# Altium schematic sheet ClubNIKA.SchDoc
size A1
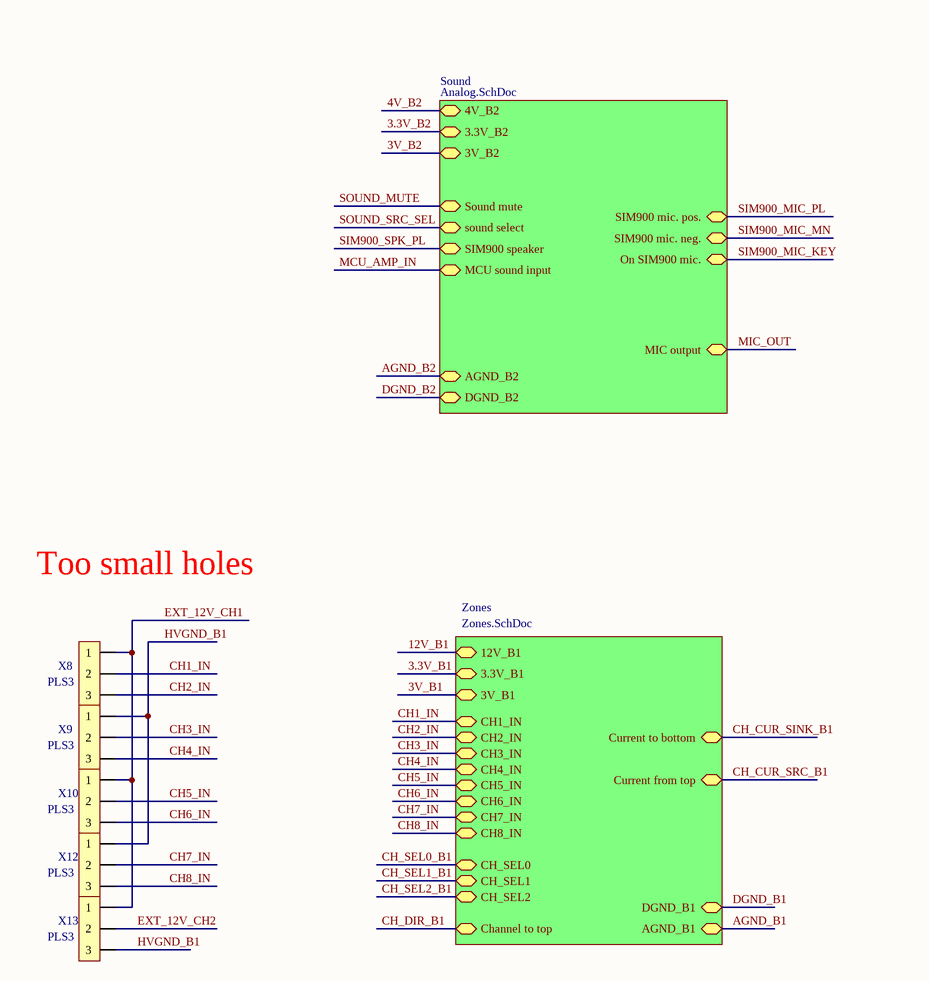
[diagram p0: ClubNIKA.SchDoc, top left]
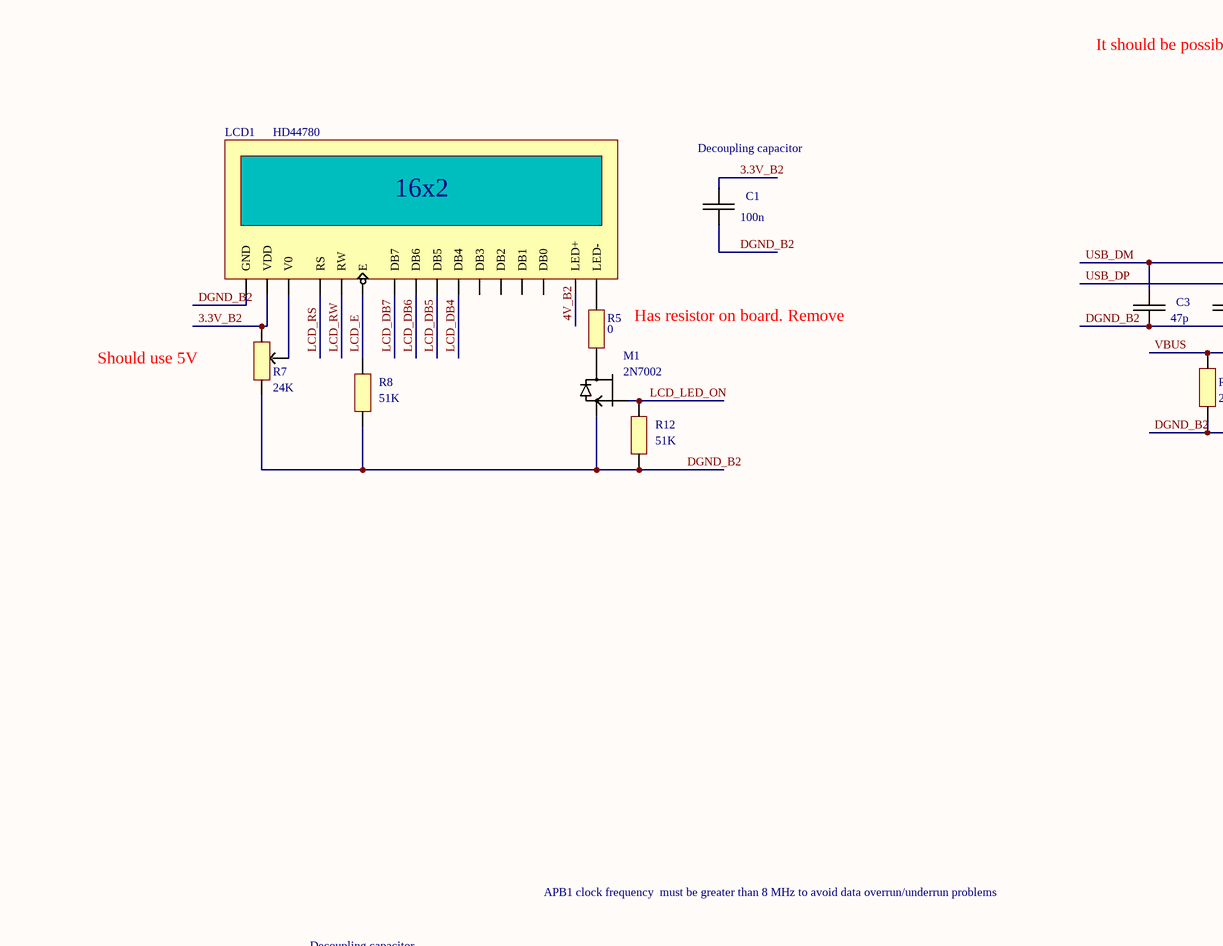
[diagram p1: ClubNIKA.SchDoc, top middle]
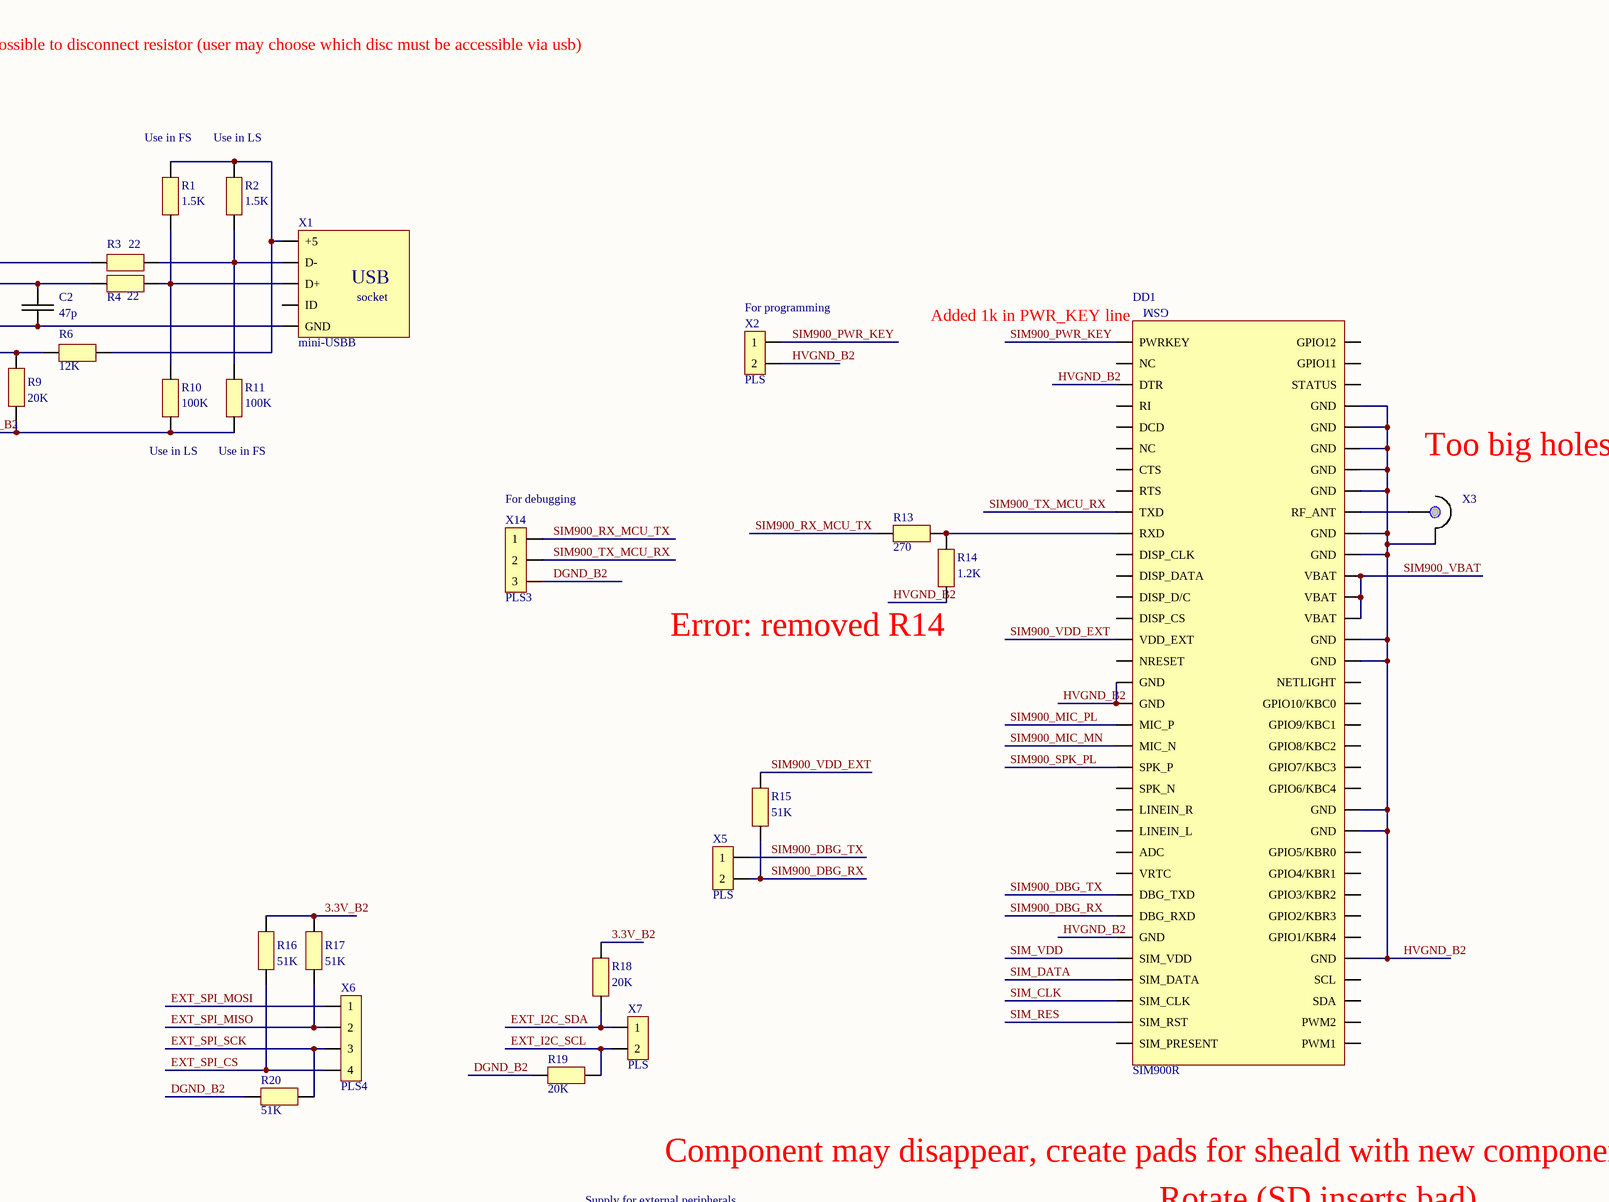
[diagram p2: ClubNIKA.SchDoc, top right]
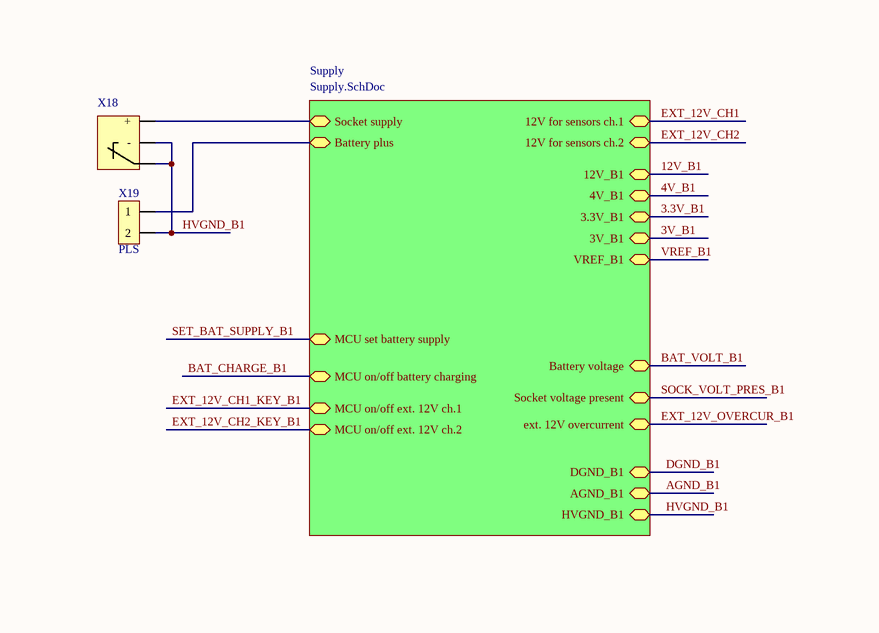
[diagram p3: ClubNIKA.SchDoc, bottom left]
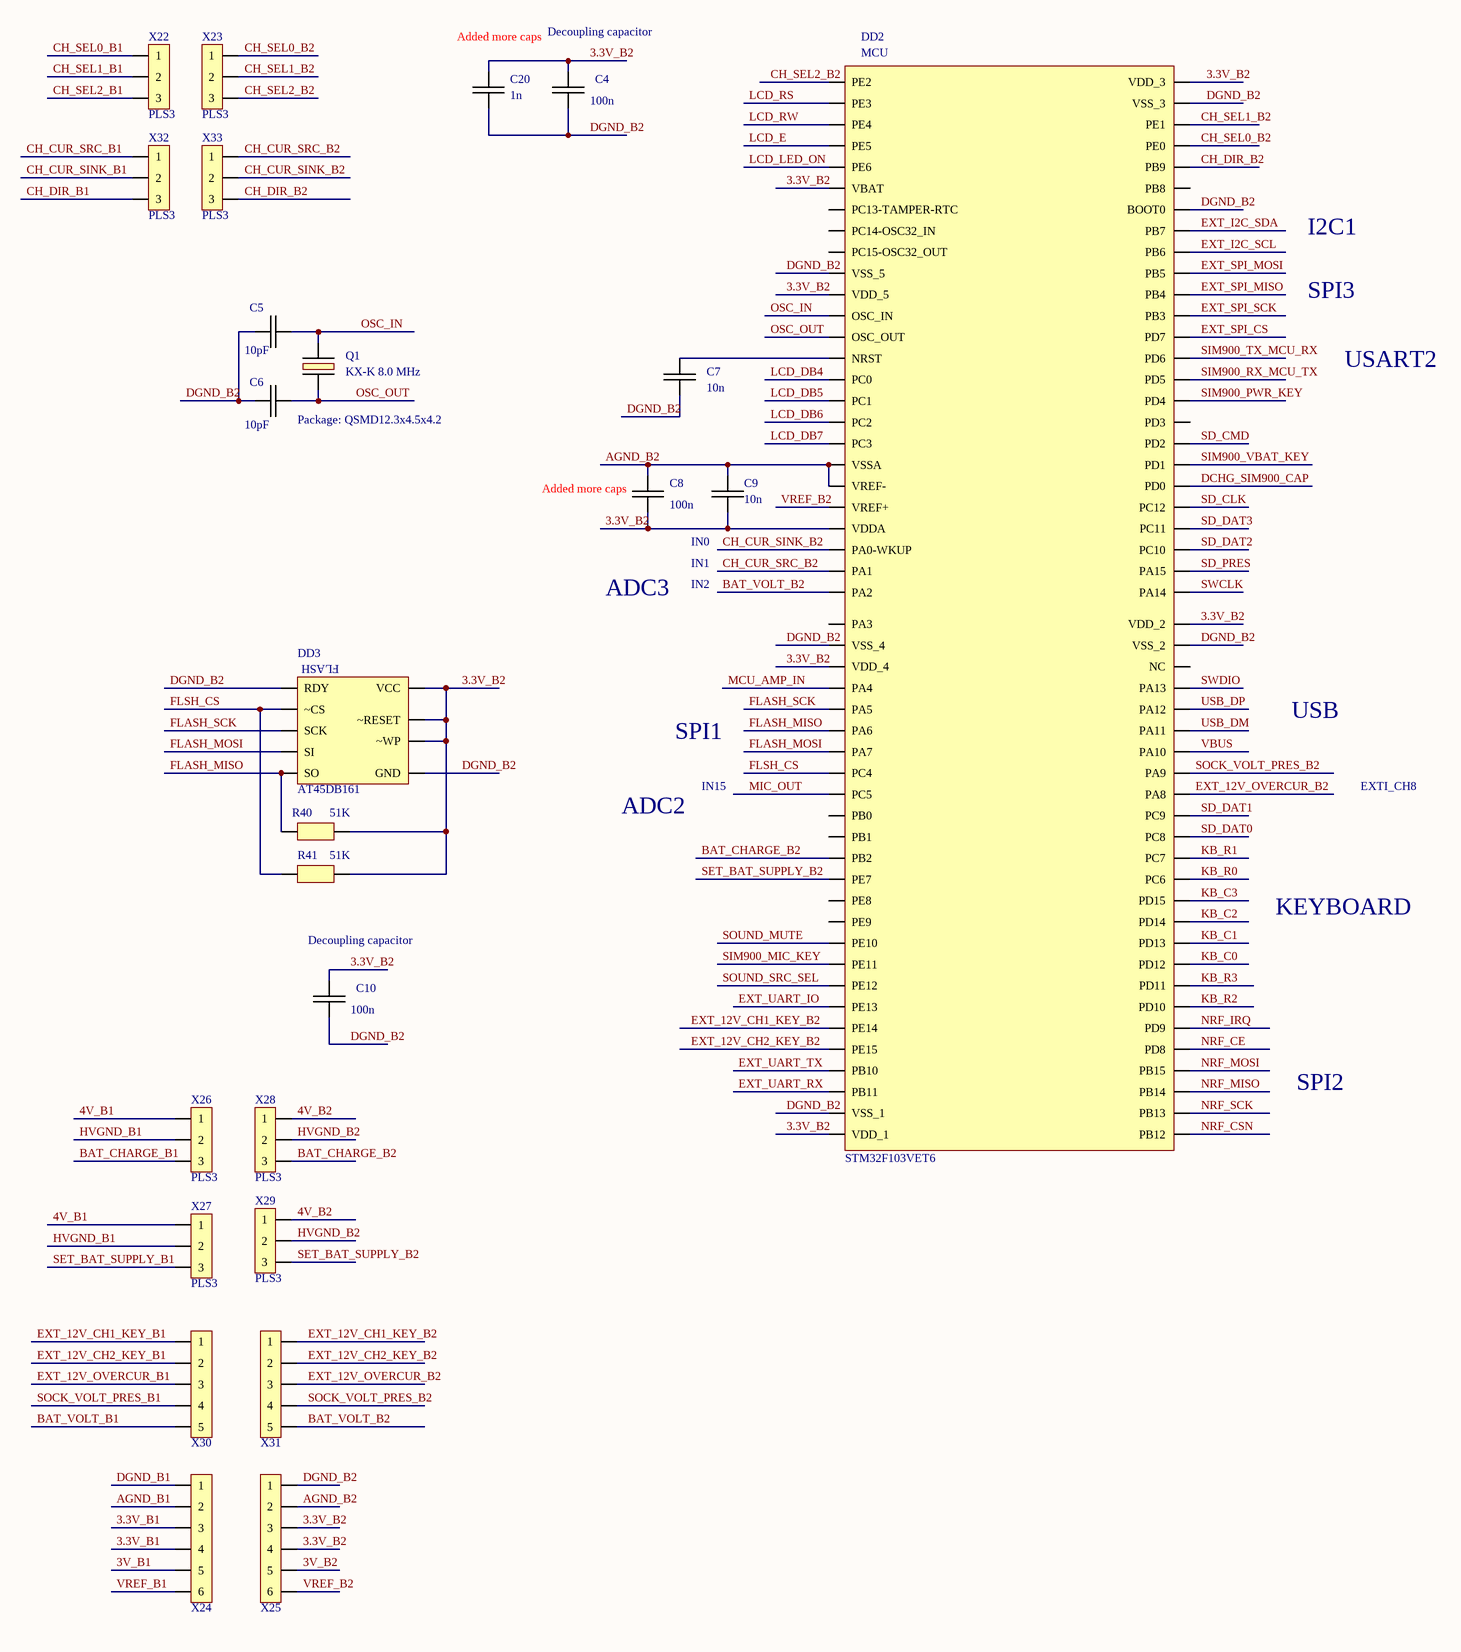
[diagram p4: ClubNIKA.SchDoc, bottom middle]
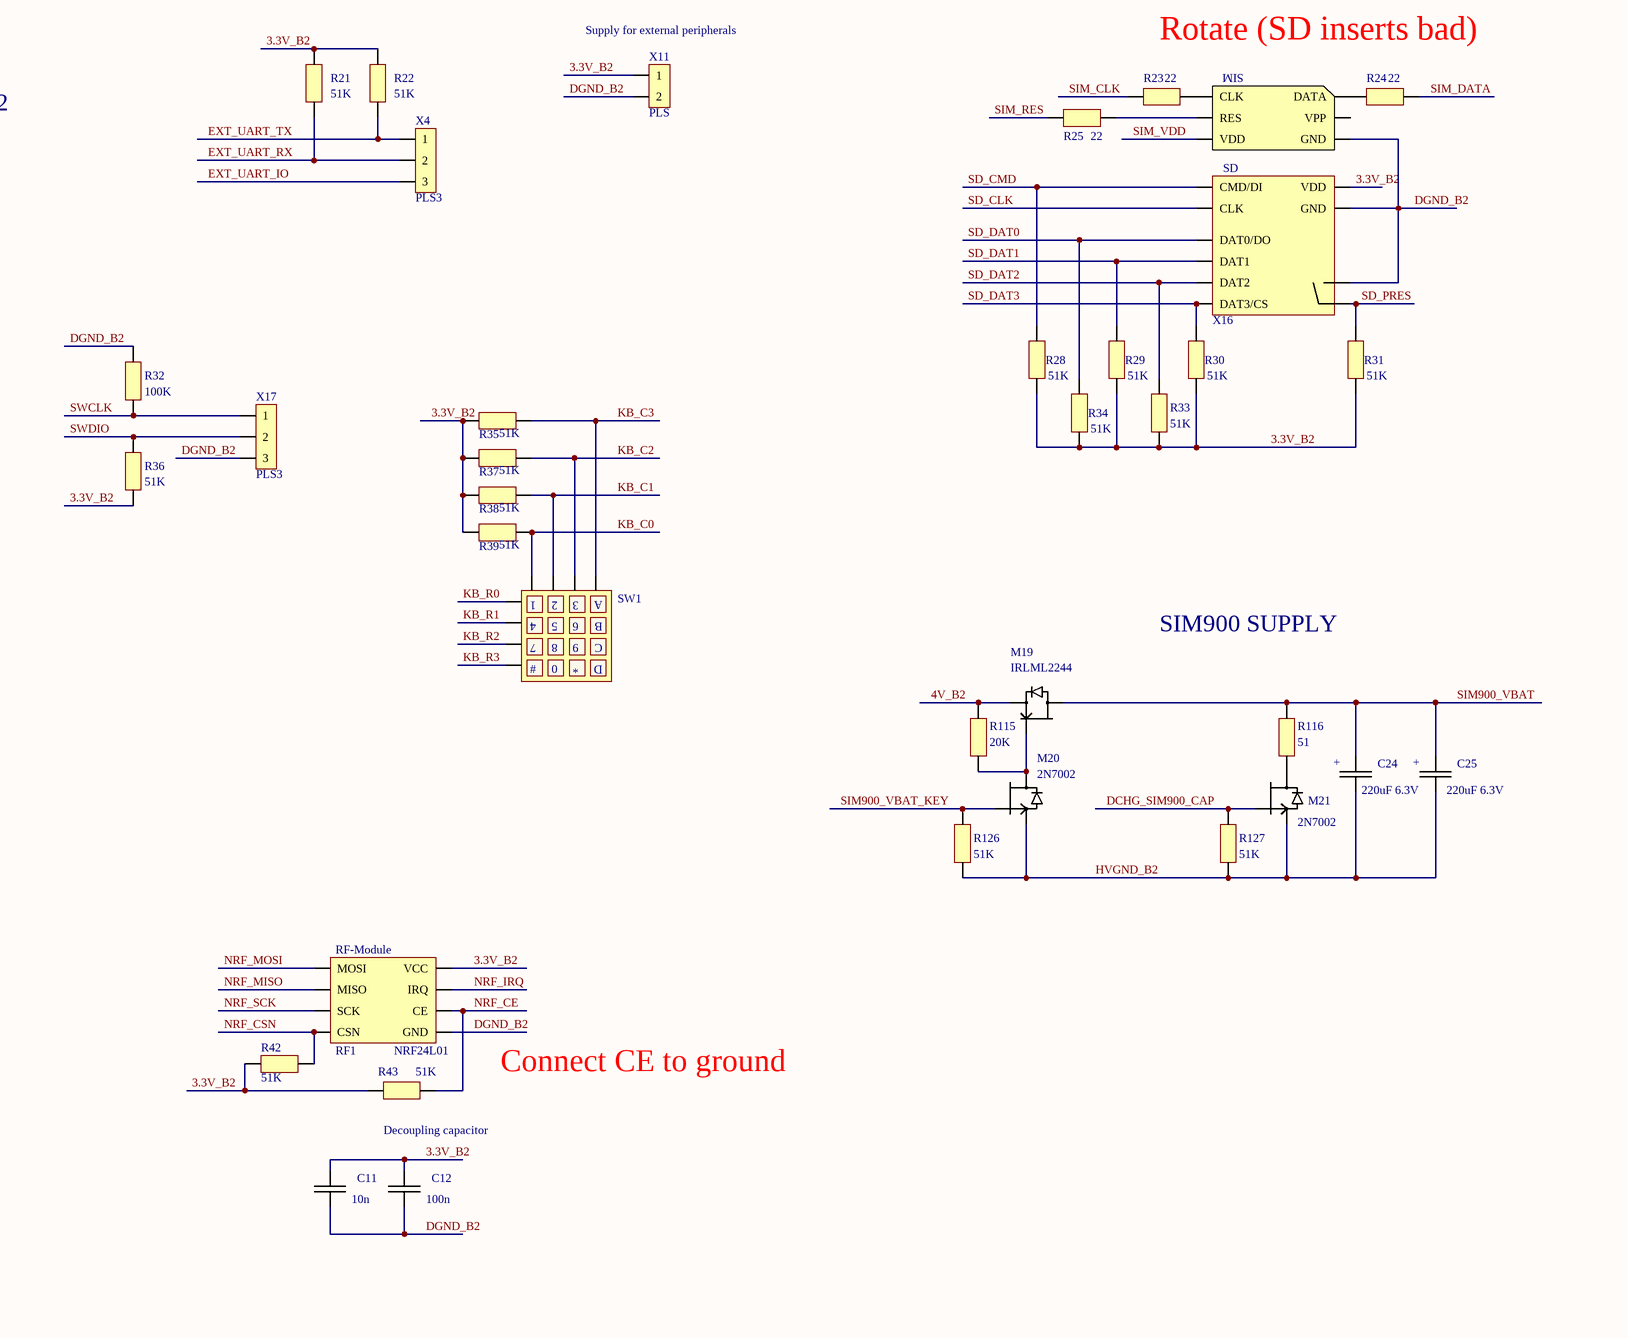
[diagram p5: ClubNIKA.SchDoc, bottom right]

## Parts
C1  100n  [0805]
C2  47p  [0805]
C3  47p  [0805]
C4  100n  [0805]
C5  10pF  [0805]
C6  10pF  [0805]
C7  10n  [0805]
C8  100n  [0805]
C9  10n  [0805]
C10  100n  [0805]
C11  10n  [0805]
C12  100n  [0805]
C20  1n  [0805]
C24  220uF 6.3V  [CALUM_THT_E5D13]
C25  220uF 6.3V  [CALUM_THT_E5D13]
DD1  SIM900R  [SIM900_R]
DD2  STM32F103VET6  [QFP100]
DD3  AT45DB161  [TSOP28]
LCD1  HD44780  [LCD_HD44780_5]
M1  2N7002  [SOT-23]
M19  IRLML2244  [SOT-23]
M20  2N7002  [SOT-23]
M21  2N7002  [SOT-23]
Q1  KX-K 8.0 MHz  [OSC1_THT_10,8x4,5]
R1  1.5K  [0805]
R2  1.5K  [0805]
R3  22  [0805]
R4  22  [0805]
R5  0  [1206]
R6  12K  [0805]
R7  24K  [3305SMD(adj res)]
R8  51K  [0805]
R9  20K  [0805]
R10  100K  [0805]
R11  100K  [0805]
R12  51K  [0805]
R13  270  [0805]
R14  1.2K  [0805]
R15  51K  [0805]
R16  51K  [0805]
R17  51K  [0805]
R18  20K  [0805]
R19  20K  [0805]
R20  51K  [0805]
R21  51K  [0805]
R22  51K  [0805]
R23  22  [0805]
R24  22  [0805]
R25  22  [0805]
R28  51K  [0805]
R29  51K  [0805]
R30  51K  [0805]
R31  51K  [0805]
R32  100K  [0805]
R33  51K  [0805]
R34  51K  [0805]
R35  51K  [0805]
R36  51K  [0805]
R37  51K  [0805]
R38  51K  [0805]
R39  51K  [0805]
R40  51K  [0805]
R41  51K  [0805]
R42  51K  [0805]
R43  51K  [0805]
R115  20K  [0805]
R116  51  [0805]
R126  51K  [0805]
R127  51K  [0805]
RF1  NRF24L01  [NRF24L01_MOD_ANGLE]
SW1  KEYBOARD4x4  [KEYBOURD_4x4_1]  (value not drawn)
X1  mini-USBB  [MINI_USBA_FEMALE]
X2  PLS  [PLS_2]
X3  SMA_FEMALE  [SMA_FEMALE]  (value not drawn)
X4  PLS3  [PLS_3]
X5  PLS  [PLS_2]
X6  PLS4  [PLS_4]
X7  PLS  [PLS_2]
X8  PLS3  [TERMINALS_7.7x15.5(step 5mm)]
X9  PLS3  [TERMINALS_7.7x15.5(step 5mm)]
X10  PLS3  [TERMINALS_7.7x15.5(step 5mm)]
X11  PLS  [PLS_2]
X12  PLS3  [TERMINALS_7.7x15.5(step 5mm)]
X13  PLS3  [TERMINALS_7.7x15.5(step 5mm)]
X14  PLS3  [PLS_3]
X16  SIM_SD_HOLDER1  [SIM_SD_HOLDER1]  (value not drawn)
X17  PLS3  [PLS_3]
X18  SUPPLY_1  [SUP_SOCK_D5.5D1.8]  (value not drawn)
X19  PLS  [PLS_2]
X22  PLS3  [PLS_3]
X23  PLS3  [PLS_3]
X24  PLS6  [PLS_6]  (value not drawn)
X25  PLS6  [PLS_6]  (value not drawn)
X26  PLS3  [PLS_3]
X27  PLS3  [PLS_3]
X28  PLS3  [PLS_3]
X29  PLS3  [PLS_3]
X30  CONT_5  [PLS_5]  (value not drawn)
X31  CONT_5  [PLS_5]  (value not drawn)
X32  PLS3  [PLS_3]
X33  PLS3  [PLS_3]

## Sub-sheets
Sound = Analog.SchDoc: Sound mute, AGND_B2, 4V_B2, 3.3V_B2, MCU sound input, SIM900 mic. pos., SIM900 mic. neg., MIC output, 3V_B2, SIM900 speaker, sound select, On SIM900 mic., DGND_B2
Supply = Supply.SchDoc: 12V for sensors ch.1, MCU on/off battery charging, Socket supply, Battery plus, Battery voltage, Socket voltage present, MCU set battery supply, ext. 12V overcurrent, 12V for sensors ch.2, MCU on/off ext. 12V ch.1, MCU on/off ext. 12V ch.2, HVGND_B1, 3.3V_B1, AGND_B1, DGND_B1, 4V_B1, VREF_B1, 12V_B1, 3V_B1
Zones = Zones.SchDoc: CH1_IN, CH2_IN, CH3_IN, CH4_IN, CH5_IN, CH6_IN, CH_SEL0, CH_SEL1, CH_SEL2, Channel to top, Current to bottom, Current from top, CH7_IN, CH8_IN, DGND_B1, AGND_B1, 3.3V_B1, 12V_B1, 3V_B1

## Nets
3.3V_B1: X24.3 X24.4 ; sheet Zones/3.3V_B1, sheet Supply/3.3V_B1
3.3V_B2: C1.2 C4.2 C8.1 C9.1 C10.2 C11.2 C12.2 C20.2 DD2.6(VBAT) DD2.11(VDD_5) DD2.22(VDDA) DD2.28(VDD_4) DD2.50(VDD_1) DD2.75(VDD_2) DD2.100(VDD_3) DD3.2(~RESET) DD3.3(~WP) DD3.6(VCC) LCD1.VDD R7.1 R16.1 R17.1 R18.1 R21.1 R22.1 R28.2 R29.2 R30.2 R31.2 R33.2 R34.2 R35.2 R36.2 R37.2 R38.2 R39.2 R40.2 R41.2 R42.1 R43.2 RF1.2(VCC) X11.1 X16.SD_VDD(VDD) X25.3 X25.4 ; sheet Sound/3.3V_B2
3V_B1: X24.5 ; sheet Zones/3V_B1, sheet Supply/3V_B1
3V_B2: X25.5 ; sheet Sound/3V_B2
4V_B1: X26.1 X27.1 ; sheet Supply/4V_B1
4V_B2: LCD1.LED+ M19.2 R115.1 X28.1 X29.1 ; sheet Sound/4V_B2
12V_B1: sheet Zones/12V_B1, sheet Supply/12V_B1
AGND_B1: X24.2 ; sheet Zones/AGND_B1, sheet Supply/AGND_B1
AGND_B2: C8.2 C9.2 DD2.19(VSSA) DD2.20(VREF-) X25.2 ; sheet Sound/AGND_B2
BAT_CHARGE_B1: X26.3 ; sheet Supply/MCU on/off battery charging
BAT_CHARGE_B2: DD2.37(PB2) X28.3
BAT_VOLT_B1: X30.5 ; sheet Supply/Battery voltage
BAT_VOLT_B2: DD2.25(PA2) X31.5
CH1_IN: X8.2 ; sheet Zones/CH1_IN
CH2_IN: X8.3 ; sheet Zones/CH2_IN
CH3_IN: X9.2 ; sheet Zones/CH3_IN
CH4_IN: X9.3 ; sheet Zones/CH4_IN
CH5_IN: X10.2 ; sheet Zones/CH5_IN
CH6_IN: X10.3 ; sheet Zones/CH6_IN
CH7_IN: X12.2 ; sheet Zones/CH7_IN
CH8_IN: X12.3 ; sheet Zones/CH8_IN
CH_CUR_SINK_B1: X32.2 ; sheet Zones/Current to bottom
CH_CUR_SINK_B2: DD2.23(PA0-WKUP) X33.2
CH_CUR_SRC_B1: X32.1 ; sheet Zones/Current from top
CH_CUR_SRC_B2: DD2.24(PA1) X33.1
CH_DIR_B1: X32.3 ; sheet Zones/Channel to top
CH_DIR_B2: DD2.96(PB9) X33.3
CH_SEL0_B1: X22.1 ; sheet Zones/CH_SEL0
CH_SEL0_B2: DD2.97(PE0) X23.1
CH_SEL1_B1: X22.2 ; sheet Zones/CH_SEL1
CH_SEL1_B2: DD2.98(PE1) X23.2
CH_SEL2_B1: X22.3 ; sheet Zones/CH_SEL2
CH_SEL2_B2: DD2.1(PE2) X23.3
DCHG_SIM900_CAP: DD2.81(PD0) M21.1 R127.1
DGND_B1: X24.1 ; sheet Zones/DGND_B1, sheet Supply/DGND_B1
DGND_B2: C1.1 C2.1 C3.1 C4.1 C5.1 C6.1 C7.1 C10.1 C11.1 C12.1 C20.1 DD2.10(VSS_5) DD2.27(VSS_4) DD2.49(VSS_1) DD2.74(VSS_2) DD2.94(BOOT0) DD2.99(VSS_3) DD3.1(RDY) DD3.7(GND) LCD1.GND M1.2 R7.2 R8.2 R9.2 R10.2 R11.2 R12.2 R19.1 R20.1 R32.1 RF1.1(GND) X1.GND X11.2 X14.3 X16.SD_GND(GND) X16.SD_PRES1 X16.SIM_GND(GND) X17.3 X25.1 ; sheet Sound/DGND_B2
EXT_12V_CH1: X8.1 X10.1 X13.1 ; sheet Supply/12V for sensors ch.1
EXT_12V_CH1_KEY_B1: X30.1 ; sheet Supply/MCU on/off ext. 12V ch.1
EXT_12V_CH1_KEY_B2: DD2.45(PE14) X31.1
EXT_12V_CH2: X13.2 ; sheet Supply/12V for sensors ch.2
EXT_12V_CH2_KEY_B1: X30.2 ; sheet Supply/MCU on/off ext. 12V ch.2
EXT_12V_CH2_KEY_B2: DD2.46(PE15) X31.2
EXT_12V_OVERCUR_B1: X30.3 ; sheet Supply/ext. 12V overcurrent
EXT_12V_OVERCUR_B2: DD2.67(PA8) X31.3
EXT_I2C_SCL: DD2.92(PB6) R19.2 X7.2
EXT_I2C_SDA: DD2.93(PB7) R18.2 X7.1
EXT_SPI_CS: DD2.88(PD7) R16.2 X6.4
EXT_SPI_MISO: DD2.90(PB4) R17.2 X6.2
EXT_SPI_MOSI: DD2.91(PB5) X6.1
EXT_SPI_SCK: DD2.89(PB3) R20.2 X6.3
EXT_UART_IO: DD2.44(PE13) X4.3
EXT_UART_RX: DD2.48(PB11) R21.2 X4.2
EXT_UART_TX: DD2.47(PB10) R22.2 X4.1
FLASH_MISO: DD2.31(PA6) DD3.14(SO) R40.1
FLASH_MOSI: DD2.32(PA7) DD3.13(SI)
FLASH_SCK: DD2.30(PA5) DD3.12(SCK)
FLSH_CS: DD2.33(PC4) DD3.11(~CS) R41.1
HVGND_B1: X9.1 X12.1 X13.3 X18.- X18.PRES X19.2 X26.2 X27.2 ; sheet Supply/HVGND_B1
HVGND_B2: C24.2 C25.2 DD1.3(DTR) DD1.17(GND) DD1.18(GND) DD1.29(GND) DD1.39(GND) DD1.45(GND) DD1.46(GND) DD1.53(GND) DD1.54(GND) DD1.58(GND) DD1.59(GND) DD1.61(GND) DD1.62(GND) DD1.63(GND) DD1.64(GND) DD1.65(GND) M20.2 M21.2 R14.2 R126.2 R127.2 X2.2 X3.2 X28.2 X29.2
KB_C0: DD2.59(PD12) R39.1 SW1.C1
KB_C1: DD2.60(PD13) R38.1 SW1.C2
KB_C2: DD2.61(PD14) R37.1 SW1.C3
KB_C3: DD2.62(PD15) R35.1 SW1.C4
KB_R0: DD2.63(PC6) SW1.R1
KB_R1: DD2.64(PC7) SW1.R2
KB_R2: DD2.57(PD10) SW1.R3
KB_R3: DD2.58(PD11) SW1.R4
LCD_DB4: DD2.15(PC0) LCD1.DB4
LCD_DB5: DD2.16(PC1) LCD1.DB5
LCD_DB6: DD2.17(PC2) LCD1.DB6
LCD_DB7: DD2.18(PC3) LCD1.DB7
LCD_E: DD2.4(PE5) LCD1.E R8.1
LCD_LED_ON: DD2.5(PE6) M1.1 R12.1
LCD_RS: DD2.2(PE3) LCD1.RS
LCD_RW: DD2.3(PE4) LCD1.RW
MCU_AMP_IN: DD2.29(PA4) ; sheet Sound/MCU sound input
MIC_OUT: DD2.34(PC5) ; sheet Sound/MIC output
NRF_CE: DD2.55(PD8) R43.1 RF1.3(CE)
NRF_CSN: DD2.51(PB12) R42.2 RF1.4(CSN)
NRF_IRQ: DD2.56(PD9) RF1.8(IRQ)
NRF_MISO: DD2.53(PB14) RF1.7(MISO)
NRF_MOSI: DD2.54(PB15) RF1.6(MOSI)
NRF_SCK: DD2.52(PB13) RF1.5(SCK)
OSC_IN: C5.2 DD2.12(OSC_IN) Q1.1
OSC_OUT: C6.2 DD2.13(OSC_OUT) Q1.2
SD_CLK: DD2.80(PC12) X16.SD_CLK(CLK)
SD_CMD: DD2.83(PD2) R28.1 X16.SD_CMD(CMD/DI)
SD_DAT0: DD2.65(PC8) R34.1 X16.SD_DAT0(DAT0/DO)
SD_DAT1: DD2.66(PC9) R29.1 X16.SD_DAT1(DAT1)
SD_DAT2: DD2.78(PC10) R33.1 X16.SD_DAT2(DAT2)
SD_DAT3: DD2.79(PC11) R30.1 X16.SD_DAT3(DAT3/CS)
SD_PRES: DD2.77(PA15) R31.1 X16.SD_PRES2
SET_BAT_SUPPLY_B1: X27.3 ; sheet Supply/MCU set battery supply
SET_BAT_SUPPLY_B2: DD2.38(PE7) X29.3
SIM900_DBG_RX: DD1.28(DBG_RXD) R15.2 X5.2
SIM900_DBG_TX: DD1.27(DBG_TXD) X5.1
SIM900_MIC_KEY: DD2.42(PE11) ; sheet Sound/On SIM900 mic.
SIM900_MIC_MN: DD1.20(MIC_N) ; sheet Sound/SIM900 mic. neg.
SIM900_MIC_PL: DD1.19(MIC_P) ; sheet Sound/SIM900 mic. pos.
SIM900_PWR_KEY: DD1.1(PWRKEY) DD2.85(PD4) X2.1
SIM900_RX_MCU_TX: DD2.86(PD5) R13.1 X14.1
SIM900_SPK_PL: DD1.21(SPK_P) ; sheet Sound/SIM900 speaker
SIM900_TX_MCU_RX: DD1.9(TXD) DD2.87(PD6) X14.2
SIM900_VBAT: C24.1 C25.1 DD1.55(VBAT) DD1.56(VBAT) DD1.57(VBAT) M19.3 R116.1
SIM900_VBAT_KEY: DD2.82(PD1) M20.1 R126.1
SIM900_VDD_EXT: DD1.15(VDD_EXT) R15.1
SIM_CLK: DD1.32(SIM_CLK) R23.2
SIM_DATA: DD1.31(SIM_DATA) R24.1
SIM_RES: DD1.33(SIM_RST) R25.2
SIM_VDD: DD1.30(SIM_VDD) X16.SIM_VDD(VDD)
SOCK_VOLT_PRES_B1: X30.4 ; sheet Supply/Socket voltage present
SOCK_VOLT_PRES_B2: DD2.68(PA9) X31.4
SOUND_MUTE: DD2.41(PE10) ; sheet Sound/Sound mute
SOUND_SRC_SEL: DD2.43(PE12) ; sheet Sound/sound select
SWCLK: DD2.76(PA14) R32.2 X17.1
SWDIO: DD2.72(PA13) R36.1 X17.2
USB_DM: C3.2 DD2.70(PA11) R3.2
USB_DP: C2.2 DD2.71(PA12) R4.2
VBUS: DD2.69(PA10) R6.2 R9.1
VREF_B1: X24.6 ; sheet Supply/VREF_B1
VREF_B2: DD2.21(VREF+) X25.6
NetC7_2: C7.2 DD2.14(NRST)
NetDD1_10: DD1.10(RXD) R13.2 R14.1
NetDD1_60: DD1.60(RF_ANT) X3.1
NetLCD1_LED-: LCD1.LED- R5.1
NetLCD1_V0: LCD1.V0 R7.3
NetM1_3: M1.3 R5.2
NetM19_1: M19.1 M20.3 R115.2
NetM21_3: M21.3 R116.2
NetR1_1: R1.1 R2.1 R6.1 X1.+5
NetR1_2: R1.2 R4.1 R10.1 X1.D+
NetR2_2: R2.2 R3.1 R11.1 X1.D-
NetR23_1: R23.1 X16.SIM_CLK(CLK)
NetR24_2: R24.2 X16.SIM_DATA(DATA)
NetR25_1: R25.1 X16.SIM_RES(RES)
NetX18_+: X18.+ ; sheet Supply/Socket supply
NetX19_1: X19.1 ; sheet Supply/Battery plus

Not connected (* = marked no-connect by the designer): DD1 2(NC) 4(RI) 5(DCD) 6(NC) 7(CTS) 8(RTS) 11(DISP_CLK) 12(DISP_DATA) 13(DISP_D/C) 14(DISP_CS) 16(NRESET) 22(SPK_N) 23(LINEIN_R) 24(LINEIN_L) 25(ADC) 26(VRTC) 34(SIM_PRESENT) 35(PWM1) 36(PWM2) 37(SDA) 38(SCL) 40(GPIO1/KBR4) 41(GPIO2/KBR3) 42(GPIO3/KBR2) 43(GPIO4/KBR1) 44(GPIO5/KBR0) 47(GPIO6/KBC4) 48(GPIO7/KBC3) 49(GPIO8/KBC2) 50(GPIO9/KBC1) 51(GPIO10/KBC0) 52(NETLIGHT) 66(STATUS) 67(GPIO11) 68(GPIO12); DD2 7(PC13-TAMPER-RTC) 8(PC14-OSC32_IN) 9(PC15-OSC32_OUT) 26(PA3) 35(PB0) 36(PB1) 39(PE8) 40(PE9) 73(NC) 84(PD3) 95(PB8); LCD1 DB0 DB1 DB2 DB3; X1 ID; X16 SIM_VPP(VPP)

## Notes on the sheet
- It should be possible to disconnect resistor (user may choose which disc must be accessible via usb)
- (near C1) Decoupling capacitor
- Use in FS
- (near R2) Use in LS
- Should use 5V
- Has resistor on board. Remove
- (near X2) For programming
- (near DD1) Added 1k in PWR_KEY line
- Use in LS
- (near R11) Use in FS
- (near X3) Too big holes
- (near X14) For debugging
- (near R14) Error: removed R14
- APB1 clock frequency  must be greater than 8 MHz to avoid data overrun/underrun problems
- Too small holes
- Added more caps
- Decoupling capacitor
- I2C1
- Component may disappear, create pads for sheald with new component
- SPI3
- (near X11) Supply for external peripherals
- Rotate (SD inserts bad)
- USART2
- Package: QSMD12.3x4.5x4.2
- (near C8) Added more caps
- IN1
- IN2
- IN0
- ADC3
- USB
- SPI1
- IN15
- EXTI_CH8
- ADC2
- KEYBOARD
- SIM900 SUPPLY
- SPI2
- Connect CE to ground
- (in symbol AT45DB161/321) FLASH
- (in symbol C_POL) +
- (in symbol KEYBOARD4x4) 1; 2; 3; A; 4; 5; 6; B; 7; 8; 9; C; #; 0; D
- (in symbol LCD 16x2 HD44780) 16x2
- (in symbol MINI_USB_FEMALE) USB; socket
- (in symbol NRF24L01) RF-Module
- (in symbol SIM900R) GSM
- (in symbol SIM_SD_HOLDER1) SIM; SD
- (in symbol STM32F103Vx) MCU

## Library data of the parts
C1-C12 C20 = C
C24 C25 = C_POL
DD2 = STM32F103Vx
DD3 = AT45DB161/321
LCD1 = LCD 16x2 HD44780
M1 M20 M21 = NMOS+DIODE
M19 = PMOS+DIODE
Q1 = XTAL
R1-R6 R8-R25 R28-R43 R115 R116 R126 R127 = R
R7 = Radj
X1 = MINI_USB_FEMALE
X2 X5 X7 X11 X19 = CONT_2
X4 X8-X10 X12-X14 X17 X22 X23 X26-X29 X32 X33 = CONT_3
X6 = CONT_4
X24 X25 = CONT_6